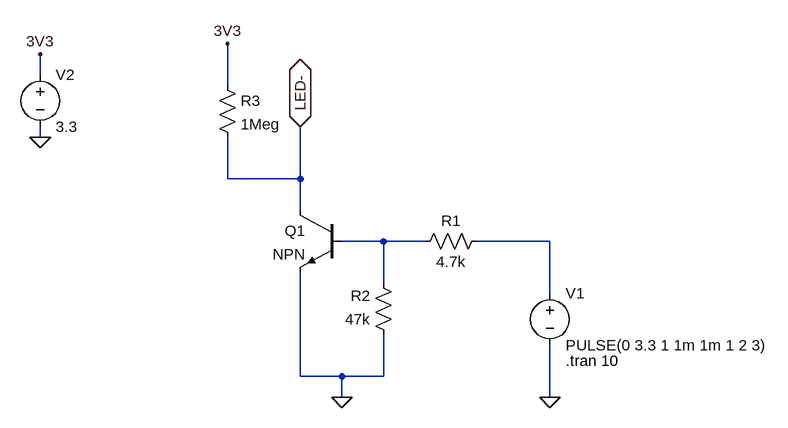
[diagram p0: schematic Draft1.asc]
Draft1.asc, the LTspice schematic file:
Version 4
SHEET 1 944 680
WIRE -176 -80 -176 -112
WIRE 112 -64 112 -128
WIRE -176 16 -176 0
WIRE 112 80 112 16
WIRE 224 80 224 0
WIRE 224 80 112 80
WIRE 224 128 224 80
WIRE 352 176 288 176
WIRE 416 176 352 176
WIRE 608 176 496 176
WIRE 352 240 352 176
WIRE 608 256 608 176
WIRE 224 384 224 224
WIRE 288 384 224 384
WIRE 352 384 352 320
WIRE 352 384 288 384
WIRE 288 416 288 384
WIRE 608 416 608 336
FLAG 288 416 0
FLAG 224 0 LED-
IOPIN 224 0 BiDir
FLAG 608 416 0
FLAG -176 16 0
FLAG -176 -112 3V3
FLAG 112 -128 3V3
SYMBOL npn 288 128 M0
SYMATTR InstName Q1
SYMBOL res 512 160 R90
WINDOW 0 0 56 VBottom 2
WINDOW 3 32 56 VTop 2
SYMATTR InstName R1
SYMATTR Value 4.7k
SYMBOL res 368 336 R180
WINDOW 0 36 76 Left 2
WINDOW 3 36 40 Left 2
SYMATTR InstName R2
SYMATTR Value 47k
SYMBOL voltage 608 240 R0
WINDOW 123 0 0 Left 0
WINDOW 39 0 0 Left 0
SYMATTR InstName V1
SYMATTR Value PULSE(0 3.3 1 1m 1m 1 2 3)
SYMBOL res 96 -80 R0
SYMATTR InstName R3
SYMATTR Value 1Meg
SYMBOL voltage -176 -96 R0
WINDOW 123 0 0 Left 0
WINDOW 39 0 0 Left 0
SYMATTR InstName V2
SYMATTR Value 3.3
TEXT 632 360 Left 2 !.tran 10

The netlist it stands for:
* Draft1.asc
Q1 LED- N001 0 0 NPN
R1 N002 N001 4.7k
R2 0 N001 47k
V1 N002 0 PULSE(0 3.3 1 1m 1m 1 2 3)
R3 3V3 LED- 1Meg
V2 3V3 0 3.3
.model NPN NPN
.model PNP PNP
.lib standard.bjt
.tran 10
.backanno
.end